# EAGLE design Bipolary (EAGLE 7.7.0)
AUTHOR: Nathan Campos; REVISION: A
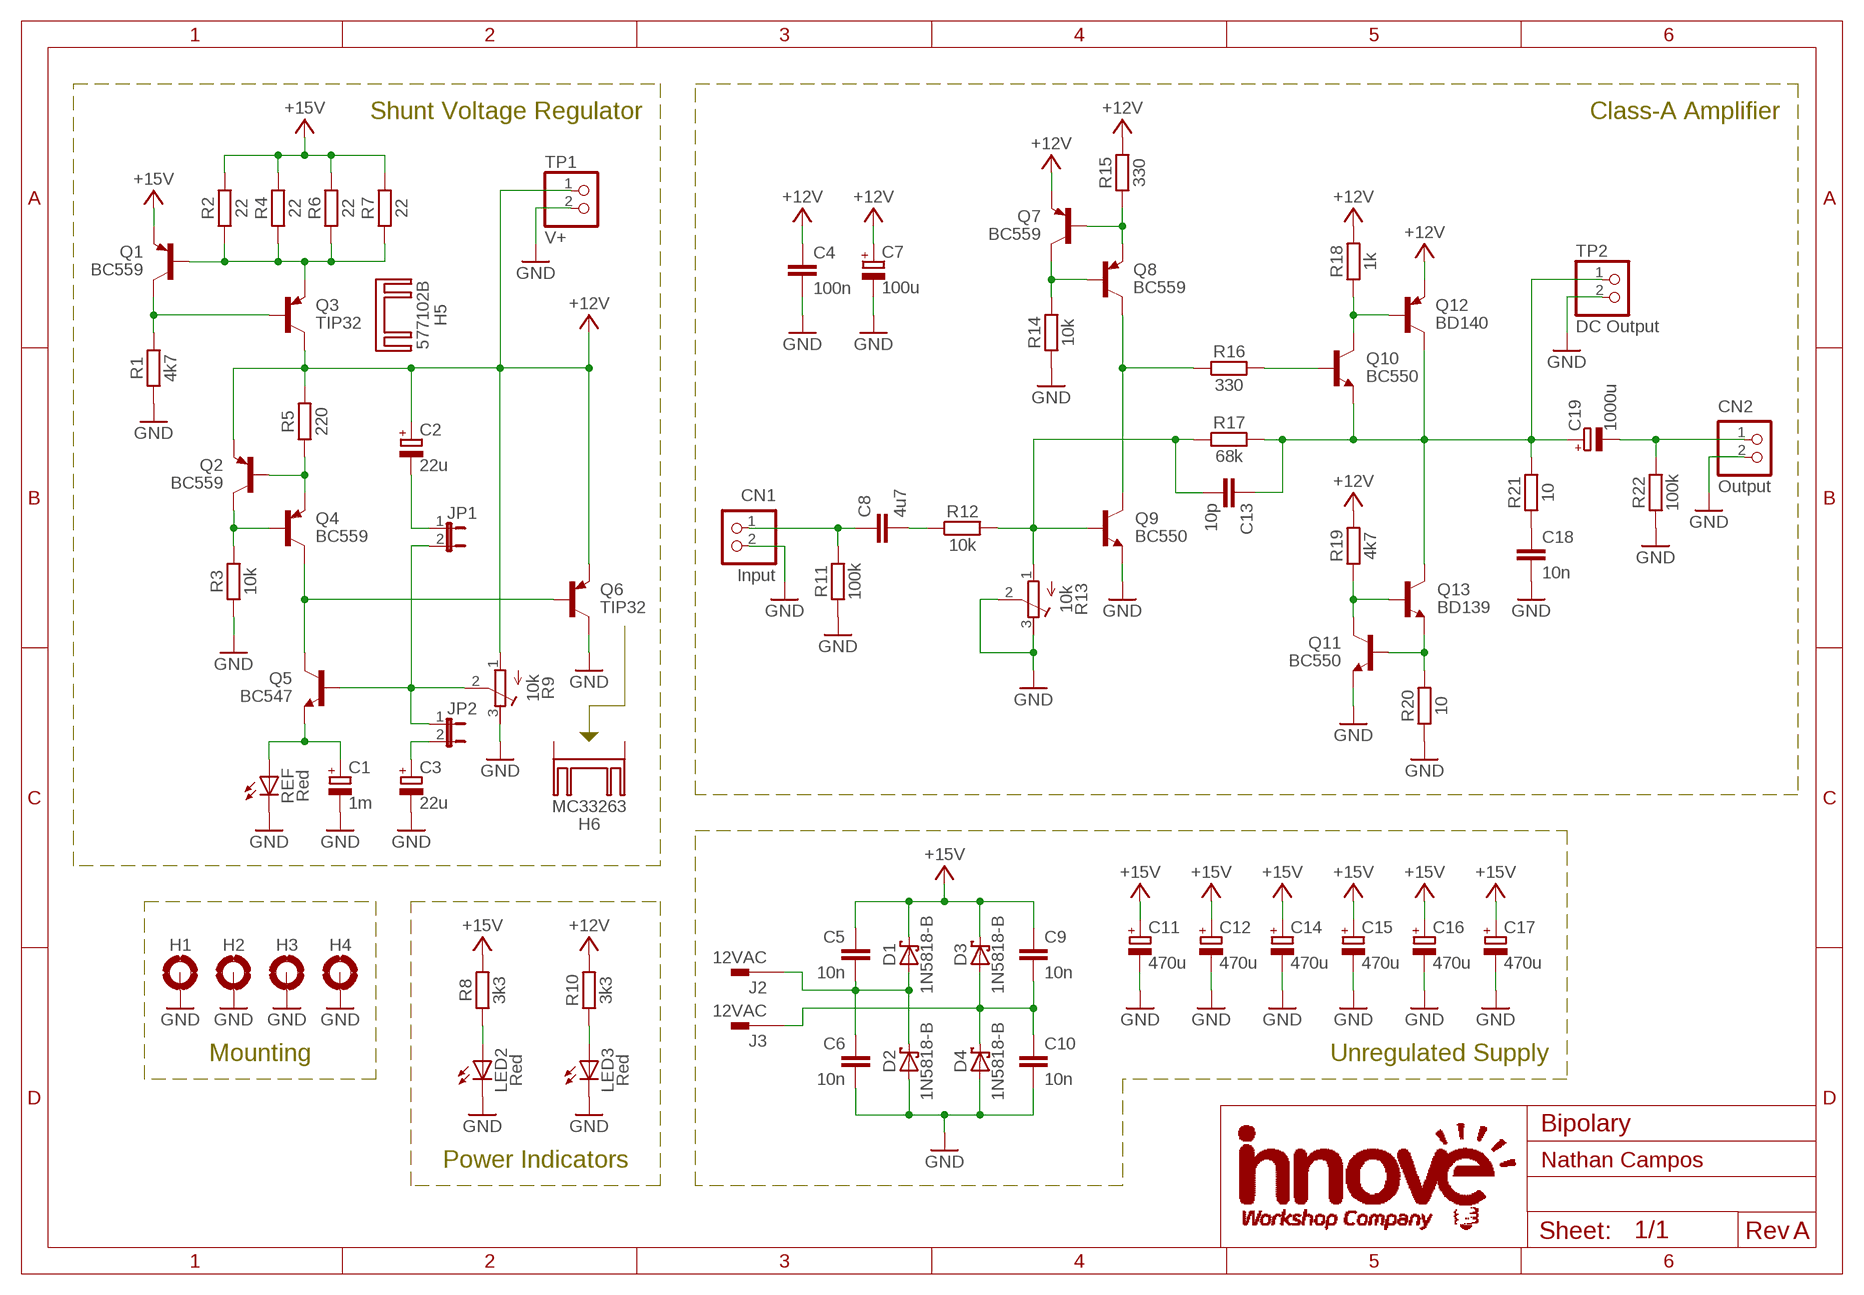
[diagram p0: schematic, sheet 1]

## Parts
C1  1m  CPOL-E3.5-8  [E3,5-8]
C2  22u  CPOL-E2-5  [E2-5]
C3  22u  CPOL-E2-5  [E2-5]
C4  100n  C5.0-2.5X7.5  [C050-025X075]
C5  10n  C5.0-2.5X7.5  [C050-025X075]
C6  10n  C5.0-2.5X7.5  [C050-025X075]
C7  100u  CPOL-E3.5-8  [E3,5-8]
C8  4u7  C15-8.4X18.3  [C150-084X183]
C9  10n  C5.0-2.5X7.5  [C050-025X075]
C10  10n  C5.0-2.5X7.5  [C050-025X075]
C11  470u  CPOL-E5-10  [E5-10]
C12  470u  CPOL-E5-10  [E5-10]
C13  10p  C5.0-2.5X7.5  [C050-025X075]
C14  470u  CPOL-E5-10  [E5-10]
C15  470u  CPOL-E5-10  [E5-10]
C16  470u  CPOL-E5-10  [E5-10]
C17  470u  CPOL-E5-10  [E5-10]
C18  10n  C5.0-2.5X7.5  [C050-025X075]
C19  1000u  CPOL-E5-10  [E5-10]
CN1  Input  B2B-XH-A  [B2B-XH-A]
CN2  Output  B2B-XH-A  [B2B-XH-A]
D1  1N5818-B  [DO41-7.6]
D2  1N5818-B  [DO41-7.6]
D3  1N5818-B  [DO41-7.6]
D4  1N5818-B  [DO41-7.6]
H1  MOUNT-PAD-ROUND3.0  [3,0-PAD]
H2  MOUNT-PAD-ROUND3.0  [3,0-PAD]
H3  MOUNT-PAD-ROUND3.0  [3,0-PAD]
H4  MOUNT-PAD-ROUND3.0  [3,0-PAD]
H5  577102B  [D02S]
H6  MC33263  [SK104-PAD]
J2  12VAC  FASTON-250D140  [F061.100]
J3  12VAC  FASTON-250D140  [F061.100]
JP1  JP1E  [JP1]
JP2  JP1E  [JP1]
LED2  Red  LED5MM  [LED5MM]
LED3  Red  LED5MM  [LED5MM]
Q1  BC559  [TO92]
Q2  BC559  [TO92]
Q3  TIP32  [TO220V]
Q4  BC559  [TO92]
Q5  BC547  [TO92]
Q6  TIP32  [TO220V]
Q7  BC559  [TO92]
Q8  BC559  [TO92]
Q9  BC550  [TO92]
Q10  BC550  [TO92]
Q11  BC550  [TO92]
Q12  BD140  [TO126V]
Q13  BD139  [TO126V]
R1  4k7  RT0207  [0207/10]
R2  22  RT0207  [0207/10]
R3  10k  RT0207  [0207/10]
R4  22  RT0207  [0207/10]
R5  220  RT0207  [0207/10]
R6  22  RT0207  [0207/10]
R7  22  RT0207  [0207/10]
R8  3k3  RT0207  [0207/10]
R9  10k  R-TRIMM3296Y  [RTRIM3296Y]
R10  3k3  RT0207  [0207/10]
R11  100k  RT0207  [0207/10]
R12  10k  RT0207  [0207/10]
R13  10k  R-TRIMM3296Y  [RTRIM3296Y]
R14  10k  RT0207  [0207/10]
R15  330  RT0207  [0207/10]
R16  330  RT0207  [0207/10]
R17  68k  RT0207  [0207/10]
R18  1k  RT0207  [0207/10]
R19  4k7  RT0207  [0207/10]
R20  10  RT0207  [0207/10]
R21  10  RT0207  [0207/10]
R22  100k  RT0207  [0207/10]
REF  Red  LED5MM  [LED5MM]
TP1  V+  PINHD-1X2  [1X02]
TP2  DC Output  PINHD-1X2  [1X02]

## Nets
+12V: C2.+ C4.1 C7.+ Q2.3(E) Q3.2(C) Q6.3(E) Q7.3(E) Q12.1(E) R5.2 R9.1(A) R10.2 R15.2 R18.2 R19.2 TP1.1
+15V: C5.1 C9.1 C11.+ C12.+ C14.+ C15.+ C16.+ C17.+ D1.C D3.C Q1.3(E) R2.2 R4.2 R6.2 R7.2 R8.2
DCOUTPUT: C13.1 C19.+ Q10.3(E) Q12.2(C) Q13.2(C) R17.2 R21.2 TP2.1
GND: C1.- C3.- C4.2 C6.2 C7.- C10.2 C11.- C12.- C14.- C15.- C16.- C17.- C18.2 CN1.2 CN2.2 D2.A D4.A H1.B3,0(MOUNT) H2.B3,0(MOUNT) H3.B3,0(MOUNT) H4.B3,0(MOUNT) LED2.K(C) LED3.K(C) Q6.2(C) Q9.3(E) Q11.3(E) R1.1 R3.1 R9.3(E) R11.1 R13.2(S) R13.3(E) R14.1 R20.1 R22.1 REF.K(C) TP1.2 TP2.2
INPUT: C8.1 CN1.1 R11.2
INTSTAGE: Q8.1(C) Q9.1(C) R16.1
N$1: Q1.1(C) Q3.1(B) R1.2
N$2: C8.2 R12.1
N$3: C5.2 C6.1 D1.A D2.C J2.A1 J2.A2
N$4: Q7.1(C) Q8.2(B) R14.2
N$5: Q7.2(B) Q8.3(E) R15.1
N$6: Q10.1(C) Q12.3(B) R18.1
N$7: Q10.2(B) R16.2
N$8: Q11.1(C) Q13.3(B) R19.1
N$9: Q11.2(B) Q13.1(E) R20.2
N$10: C18.1 R21.1
N$11: Q1.2(B) Q3.3(E) R2.1 R4.1 R6.1 R7.1
N$12: Q2.2(B) Q4.3(E) R5.1
N$13: Q2.1(C) Q4.2(B) R3.2
N$14: Q4.1(C) Q5.1(C) Q6.1(B)
N$15: C1.+ Q5.3(E) REF.A
N$16: JP1.2 JP2.1 Q5.2(B) R9.2(S)
N$17: C2.- JP1.1
N$18: C3.+ JP2.2
N$19: C9.2 C10.1 D3.A D4.C J3.A1 J3.A2
N$20: LED3.A R10.1
N$21: LED2.A R8.1
NFB: C13.2 Q9.2(B) R12.2 R13.1(A) R17.1
OUTPUT: C19.- CN2.1 R22.2
Unconnected: H6.K1(K) H6.K2(K)

## Notes on the sheet
- Shunt Voltage Regulator | Class-A Amplifier
- Mounting | Unregulated Supply
- Power Indicators

## Library data of the parts
C1-C3 C7 C11 C12 C14-C17 C19 = innove-passives:CPOL: Polarized Capacitor May come in the electrolytic and tantalum variants
C4-C6 C8-C10 C13 C18 = innove-passives:C: Ceramic Capacitor Those little yellow/brown things
CN1 CN2 = innove-con-jst-xh:B2B-XH-A: Wire-to-Board 2.5mm pitch top mount connector Source: http://www.jst-mfg.com/product/pdf/jpn/XH.pdf http://www.jst-mfg.com/product/detail.php?series=277
D1-D4 = innove-diodes:1N581*: Schottky Rectifier - 1N5817/8/9 Schottky Rectifier, 20 V, 1 A, Single, DO-41 (DO-204AL), 2 Pins, 450 mV Source: http://www.diodes.com/datasheets/ds23001.pdf
H1-H4 = innove-holes:MOUNT-PAD-ROUND: MOUNTING PAD, round
H5 = innove-heatsinks:577102B: 577102B00000G - Aavid/Boyd Heat Sink, Square, PCB, 25.9 °C/W, TO-220, 13.21 mm, 9.52 mm, 19.05 mm Datasheet: https://info.boydcorp.com/hubfs/Thermal/Air-Cooling/Boyd-Board-Level-Cooling-Channel-5770.pdf
H6 = innove-heatsinks:MC3326: MC33263/MC33264 - Multicomp Compact, vertical mounting extruded heatsink with solderable fixing pins. Designed for a single TO-220 package via clip available separately or mounting holes. MC33263 - 13.4°C/W - H 25.4mm MC33264 - 10.4°C/W - H 38.1mm
J2 J3 = innove-con-faston:FASTON-250: FASTON 250 - Printed Circuit Board Tabs Tab size: 6.35mm x 0.81mm; OC_FARNELL: unknown; OC_NEWARK: unknown
JP1 JP2 = jumper:JP1E: JUMPER
LED2 LED3 REF = innove-leds:LED: LED OSRAM: - CHIPLED LG R971, LG N971, LY N971, LG Q971, LY Q971, LO R971, LY R971 LH N974, LH R974 LS Q976, LO Q976, LY Q976 LO Q996 - Hyper CHIPLED LW Q18S LB Q993, LB Q99A, LB R99A - SideLED LS A670, LO A670, LY A670, LG A670, LP A670 LB A673, LV A673, LT A673, LW A673 LH A674 LY A675 LS A676, LA A676, LO A676, LY A676, LW A676 LS A679, LY A679, LG A679 - Hyper Micro SIDELED® LS Y876, LA Y876, LO Y876, LY Y876 LT Y87S - SmartLED LW L88C, LW L88S LB L89C, LB L89S, LG L890 LS L89K, LO L89K, LY L89K LS L896, LA L896, LO L896, LY L896 - TOPLED LS T670, LO T670, LY T670, LG T670, LP T670 LSG T670, LSP T670, LSY T670, LOP T670, LYG T670 LG T671, LOG T671, LSG T671 LB T673, LV T673, LT T673, LW T673 LH T674 LS T676, LA T676, LO T676, LY T676, LB T676, LH T676, LSB T676, LW T676 LB T67C, LV T67C, LT T67C, LS T67K, LO T67K, LY T67K, LW E67C LS E67B, LA E67B, LO E67B, LY E67B, LB E67C, LV E67C, LT E67C LW T67C LS T679, LY T679, LG T679 LS T770, LO T770, LY T770, LG T770, LP T770 LB T773, LV T773, LT T773, LW T773 LH T774 LS E675, LA E675, LY E675, LS T675 LS T776, LA T776, LO T776, LY T776, LB T776 LHGB T686 LT T68C, LB T68C - Hyper Mini TOPLED® LB M676 - Mini TOPLED Santana® LG M470 LS M47K, LO M47K, LY M47K Source: http://www.osram.convergy.de LUXEON: - LUMILED® LXK2-PW12-R00, LXK2-PW12-S00, LXK2-PW14-U00, LXK2-PW14-V00 LXK2-PM12-R00, LXK2-PM12-S00, LXK2-PM14-U00 LXK2-PE12-Q00, LXK2-PE12-R00, LXK2-PE12-S00, LXK2-PE14-T00, LXK2-PE14-U00 LXK2-PB12-K00, LXK2-PB12-L00, LXK2-PB12-M00, LXK2-PB14-N00, LXK2-PB14-P00, LXK2-PB14-Q00 LXK2-PR12-L00, LXK2-PR12-M00, LXK2-PR14-Q00, LXK2-PR14-R00 LXK2-PD12-Q00, LXK2-PD12-R00, LXK2-PD12-S00 LXK2-PH12-R00, LXK2-PH12-S00 LXK2-PL12-P00, LXK2-PL12-Q00, LXK2-PL12-R00 Source: www.luxeon.com KINGBRIGHT: KA-3528ASYC Source: www.kingbright.com
Q1 Q2 Q4 Q7 Q8 = innove-bjts:BC559
Q3 Q6 = innove-bjts:TIP32
Q5 = innove-bjts:BC547
Q9-Q11 = innove-bjts:BC550
Q12 = innove-bjts:BD140
Q13 = innove-bjts:BD139
R1-R8 R10-R12 R14-R22 = innove-passives:R: Resistor This is officially the most boring component ever.
R9 R13 = innove-passives:R-TRIMM: Trimm resistor
TP1 TP2 = pinhead:PINHD-1X2: PIN HEADER

## Board
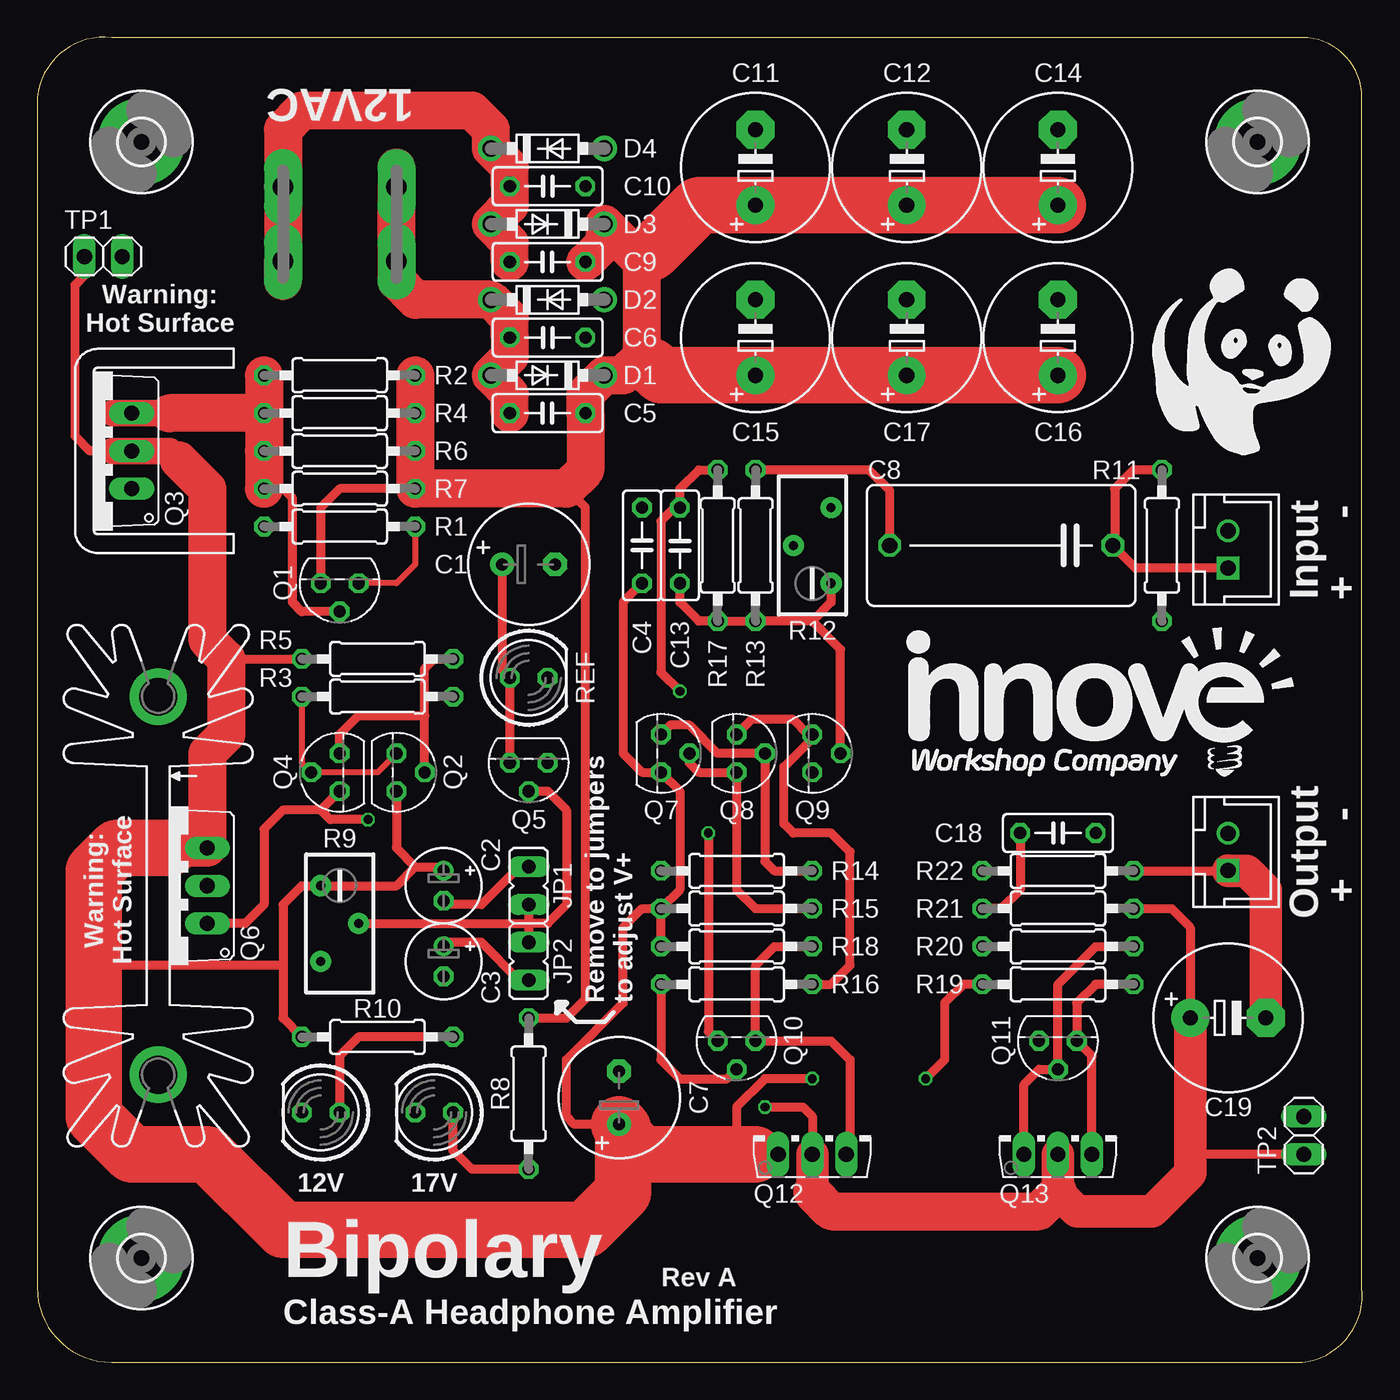
[diagram p1: board, top side]
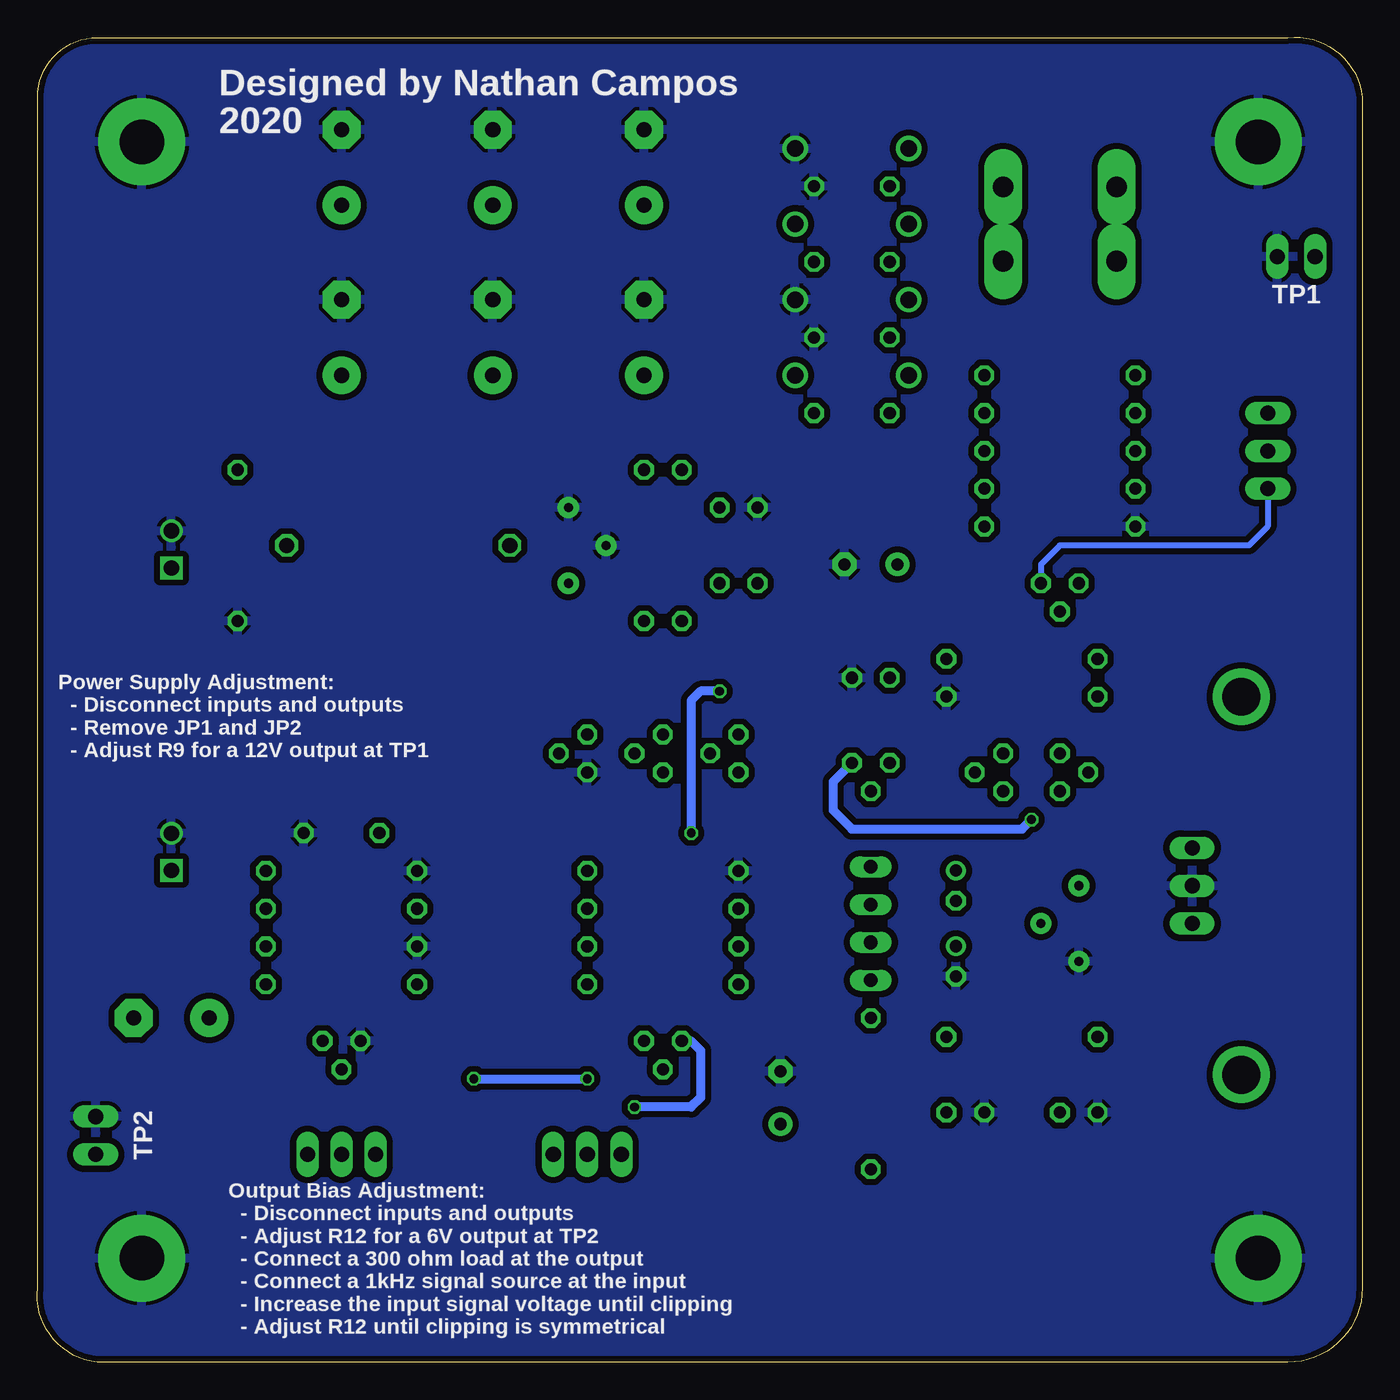
[diagram p2: board, bottom side, seen from below]

Size 89.03 x 89.03 mm. Coordinates in mm from the lower left corner, seen from the top.
Outline: 85,89 5,89 arc90 0,85 0,5 arc90 5,0 85,0 arc90 89,5 89,85 arc90 85,89
Copper layers (1*16): Top 0.035mm / dielectric 1.5mm / Bottom 0.035mm
Design rules "seeedstudio-2layers": minimum track width 6mil, minimum drill 12mil, track to track 6mil, track to pad 6mil, pad to pad 6mil, via to via 6mil, smd to smd 0mil, copper to edge 10mil, drill to drill 10mil, minimum pad ring 10mil, minimum via ring 6mil, stop-mask expansion 2mil, vias tented up to drill 100mil, thermal gap 10mil

### Footprints (pad centres in the part's own frame; a part is rotated, then mirrored left to right if it is on the bottom)
E3,5-8 = drill 0.813 pad 1.6: + -1.778,0 | drill 0.813 pad 1.6 octagon: - 1.778,0
E2-5 = drill 0.813 pad 1.27: + -1.016,0 | drill 0.813 pad 1.27 octagon: - 1.016,0
C050-025X075 = drill 0.813 octagon: 1 -2.54,0; 2 2.54,0
C150-084X183 = drill 1.016 octagon: 1 -7.493,0; 2 7.493,0
E5-10 = drill 1.016 pad 2.54: + -2.54,0 | drill 1.016 pad 2.54 octagon: - 2.54,0
B2B-XH-A = drill 1.016 square: 1 -1.25,0 | drill 1.016: 2 1.25,0
DO41-7.6 = drill 1.1 pad 1.7: A 3.81,0; C -3.81,0
3,0-PAD = drill 3 pad 5.842: B3,0 0,0
SK104-PAD = drill 2.54 pad 3.81: K1 -12.7,-0.762; K2 12.7,-0.762
F061.100 = drill 1.4 pad 2.54 long: A1 -2.5,0; A2 2.5,0
JP1 = drill 0.914 long: 1 0,-1.27; 2 0,1.27
LED5MM = drill 0.813 octagon: A -1.27,0; K 1.27,0
TO92 = drill 0.813 octagon: 1 -1.27,0; 2 0,1.905; 3 1.27,0
TO220V = drill 1.016 long: 1 -2.54,-2.54; 2 0,-2.54; 3 2.54,-2.54
TO126V = drill 1.016 long: 1 -2.286,-1.27; 2 0,-1.27; 3 2.286,-1.27
0207/10 = drill 0.813 octagon: 1 -5.08,0; 2 5.08,0
RTRIM3296Y = drill 0.61 pad 1.422: 1 1.27,-2.54; 2 -1.27,0; 3 1.27,2.54
1X02 = drill 1.016 long: 1 -1.27,0; 2 1.27,0

### Placement (x,y rotation side)
C1  33.02,53.61 0 top
C2  27.3,32.02 270 top
C3  27.3,26.94 270 top
C4  40.64,54.88 90 top
C5  34.29,63.77 180 top
C6  34.29,68.85 0 top
C7  39.1,17.78 90 top
C8  64.77,54.88 180 top
C9  34.29,73.93 180 top
C10  34.29,79.01 0 top
C11  48.26,80.28 90 top
C12  58.42,80.28 90 top
C13  43.18,54.88 270 top
C14  68.58,80.28 90 top
C15  48.26,68.85 90 top
C16  68.58,68.85 90 top
C17  58.42,68.85 90 top
C18  68.58,35.56 0 top
C19  80.01,23.13 0 top
CN1  80.01,54.61 90 top
CN2  80.01,34.29 90 top
D1  34.29,66.31 180 top
D2  34.29,71.39 0 top
D3  34.29,76.47 180 top
D4  34.29,81.55 0 top
H1  7,7 0 top
H2  82,7 0 top
H3  82,82 0 top
H4  7,82 0 top
H5  3.81,61.23 270 top
H6  8.89,32.02 270 top
J2  24.13,76.47 270 top
J3  16.51,76.47 270 top
JP1  33.02,32.02 180 top
JP2  33.02,26.94 180 top
LED2  26.67,16.78 180 top
LED3  19.05,16.78 180 top
Q1  20.32,52.34 180 top
Q2  24.13,39.64 270 top
Q3  3.81,61.23 90 top
Q4  20.32,39.64 90 top
Q5  33.02,40.27 180 top
Q6  8.89,32.02 90 top
Q7  41.91,40.91 270 top
Q8  46.99,40.91 270 top
Q9  52.07,40.91 270 top
Q10  46.99,21.59 180 top
Q11  68.58,21.59 180 top
Q12  52.07,15.24 0 top
Q13  68.58,15.24 0 top
R1  20.32,56.15 0 top
R2  20.32,66.31 0 top
R3  22.86,44.72 180 top
R4  20.32,63.77 0 top
R5  22.86,47.26 180 top
R6  20.32,61.23 0 top
R7  20.32,58.69 0 top
R8  33.02,18.05 90 top
R9  20.32,29.48 180 top
R10  22.86,21.86 180 top
R11  75.56,54.88 90 top
R12  48.26,54.88 270 top
R13  52.07,54.88 0 top
R14  46.99,33.02 0 top
R15  46.99,30.48 180 top
R16  46.99,25.4 180 top
R17  45.72,54.88 90 top
R18  46.99,27.94 180 top
R19  68.58,25.4 180 top
R20  68.58,27.94 0 top
R21  68.58,30.48 0 top
R22  68.58,33.02 0 top
REF  33.02,45.99 0 top
TP1  4.45,74.3 0 top
TP2  85.09,15.24 90 top

### Tracks (layer width: path | path; a pad name or v marks a point on that pad's centre or on a via)
+12V  (via drill 0.6)
  Top 0.61: 12.7,47.26 R5.2 | 25.4,33.29 24.13,32.02 R9.1 17.78,32.02 16.51,30.75 16.51,26.67 | 25.4,33.29 27.05,33.29 C2.+ | Q2.3 24.13,34.56 25.4,33.29 | R10.2 16.51,23.13 16.51,26.67 | C4.1 39.37,51.07 39.37,40.91 40.64,39.64 Q7.3 43.18,38.37 43.18,31.75 R15.2 | R18.2 R15.2 | C7.+ 36.07,16 35.56,16.51 35.56,20.32 39.37,24.13 39.37,29.21 40.64,30.48 R15.2 | R19.2 62.23,25.4 60.96,24.13 60.96,20.32 v59.69,19.05 | v52.07,19.05 48.9,19.05 46.99,17.14 46.99,13.97 | 16.51,26.67 3.81,26.67 | TP1.1 3.17,73.03 2.54,72.39 2.54,62.23 3.54,61.23 5.08,61.23
  Top 1.016: 11.43,35.2 Q6.3
  Top 1.422: 48.26,13.97 Q12.1
  Top 1.778: 5.08,61.23 Q3.2 8.89,61.23 9.53,60.59
  Top 2.54: 9.53,60.59 11.43,58.69 11.43,48.53 12.7,47.26 12.7,42.18 11.43,40.91 11.43,35.2 | Q6.3 9.92,34.56 9.91,34.54 8.89,34.54
  Top 3.81: 8.89,34.54 5.33,34.54 3.81,33.02 3.81,26.67 3.81,16.51 6.35,13.97 11.43,13.97 16.51,8.89 36.83,8.89 39.37,11.43 39.37,15.24 | C7.+ 39.37,15.73 39.37,15.24 | 39.37,15.24 40.64,13.97 46.99,13.97 48.26,13.97
  Bottom 0.61: v59.69,19.05 v52.07,19.05
+15V
  Top 0.61: R7.2 20.32,58.69 19.05,57.42 Q1.3 | 35.56,58.69 36.83,57.42 36.83,24.4 35.56,23.13 R8.2
  Top 1.93: 41.27,66.94 40.64,67.58 | 41.27,74.56 40.64,73.93
  Top 2.54: C9.1 38.1,75.2 D3.C 40.64,73.93 40.64,67.58 39.37,66.31 D1.C 36.83,65.04 C5.1 36.83,59.96 35.56,58.69 R7.2 R6.2 R4.2 R2.2
  Top 3.81: C14.+ C12.+ C11.+ 44.45,77.74 41.27,74.56 | C16.+ C17.+ C15.+ 41.91,66.31 41.27,66.94
DCOUTPUT  (via drill 0.6)
  Top 0.61: R17.2 44.45,59.96 43.18,58.69 C13.1 42.81,57.42 41.91,56.52 41.91,46.35 v43.18,45.09 | v48.9,17.14 51.44,17.14 52.07,16.51 Q12.2 | R21.2 76.2,30.48 77.47,29.21 C19.+ | v45.09,35.56 45.09,22.23 Q10.3 | TP2.1 77.47,13.97
  Top 2.184: Q12.2 52.07,11.43 | Q13.2 68.58,11.43 69.85,10.16 74.93,10.16 77.47,12.7 77.47,13.97 C19.+
  Top 2.54: 52.07,11.43 53.34,10.16 67.31,10.16 68.58,11.43
  Bottom 0.61: v48.9,17.14 45.09,17.14 44.45,17.78 44.45,20.95 45.09,21.59 Q10.3 | v43.18,45.09 44.45,45.09 45.09,44.45 v45.09,35.56
GND
  pour Bottom (isolate 0.406): -1.27,90.17 90.17,90.17 90.17,-1.27 -1.27,-1.27
INPUT
  Top 0.61: R11.2 73.66,59.96 72.39,58.69 72.39,55.01 C8.1 73.78,53.36 CN1.1
INTSTAGE
  Top 0.61: R16.1 53.34,25.4 54.61,26.67 54.61,34.29 53.34,35.56 50.8,35.56 50.16,36.2 50.16,40.01 52.07,41.91 Q9.1 51.8,42.18 50.8,43.18 47.99,43.18 Q8.1
N$1
  Top 0.406: R1.2 25.4,53.61 24.13,52.34 Q1.1
  Bottom 0.406: Q3.1 6.35,56.15 7.62,54.88 20.32,54.88 21.59,53.61 Q1.1
N$2
  Top 0.61: C8.2 57.28,58.56 55.88,59.96 R12.1
N$3
  Top 2.54: C5.2 31.75,65.04 D1.A 31.75,67.58 C6.1 31.75,70.12 D2.C 25.4,71.39 24.13,72.66 J2.A2 J2.A1 24.13,80.28
N$4
  Top 0.61: Q7.1 42.55,42.81 43.81,42.81 45.72,40.91 Q8.2 48.9,33.66 49.53,33.02 R14.2
N$5
  Top 0.61: Q7.2 43.81,40.27 44.45,39.64 Q8.3 46.99,31.75 48.26,30.48 R15.1
N$6
  Top 0.61: R18.1 49.53,27.94 48.26,26.67 Q10.1 53.34,21.59 54.61,20.32 54.61,14.22 Q12.3
N$7
  Top 0.61: R16.2 41.91,20.32 43.18,19.05 46.35,19.05 Q10.2
N$8
  Top 0.61: Q13.3 70.87,20.57 Q11.1 69.85,24.13 71.12,25.4 R19.1
N$9
  Top 0.61: Q13.1 66.29,18.67 67.31,19.68 Q11.2 68.58,25.4 71.12,27.94 R20.2
N$10
  Top 0.61: C18.1 66.04,31.75 64.77,30.48 R21.1
N$11
  Top 0.61: Q1.2 17.78,50.44 17.14,51.07 17.14,58.05 16.51,58.69 R7.1
  Top 1.778: 8.89,63.77 Q3.3 5.08,63.77
  Top 2.54: R2.1 R4.1 | R4.1 R6.1 R7.1 | R4.1 8.89,63.77
N$12
  Top 0.61: Q2.2 26.04,43.45 | 26.04,43.45 26.04,46.62 26.67,47.26 R5.1 | Q4.3 20.32,42.18 21.59,43.45 26.04,43.45
N$13
  Top 0.406: Q2.1 22.86,39.64 Q4.2 17.78,40.27 R3.2
N$14  (via drill 0.6)
  Top 0.61: Q4.1 19.05,37.1 | 19.05,37.1 16.51,37.1 15.24,35.83 15.24,30.75 13.97,29.48 Q6.1 | v22.23,36.47 19.68,36.47 19.05,37.1
  Bottom 0.61: Q5.1 35.56,39.01 35.56,37.1 34.29,35.83 22.86,35.83 v22.23,36.47
N$15
  Top 0.61: C1.+ 31.24,46.5 REF.A Q5.3
N$16
  Top 0.61: JP1.2 33.02,29.48 | 33.02,29.48 JP2.1 | R9.2 33.02,29.48 | Q5.2 34.29,38.37 35.56,37.1 35.56,30.75 34.29,29.48 33.02,29.48
N$17
  Top 0.61: JP1.1 32.38,33.29 29.84,30.75 27.56,30.75 C2.-
N$18
  Top 0.61: JP2.2 32.38,25.67 29.84,28.21 27.56,28.21 C3.+
N$19
  Top 2.54: C9.2 31.75,75.2 D3.A 31.75,77.74 C10.1 31.75,80.28 D4.C 30.48,82.82 29.21,84.09 17.78,84.09 16.51,82.82 J3.A1 J3.A2 16.51,72.66
N$20
  Top 0.61: R10.1 21.59,21.86 20.32,20.59 LED3.A
N$21
  Top 0.61: R8.1 29.21,12.97 27.94,14.24 LED2.A
NFB
  Top 0.61: R13.1 53.34,51.07 52.07,49.8 | 52.07,49.8 R12.2 R17.1 44.45,49.8 43.18,51.07 C13.2 | Q9.2 53.98,47.9 52.07,49.8
OUTPUT
  Top 0.61: R22.2 79.99,33.02 CN2.1
  Top 2.184: C19.- 82.55,31.75 81.28,33.02 80.01,33.02 CN2.1

### Text on the board
tPlace: 12VAC | Warning: / Hot Surface | - | Input | + | - | Output | Warning: / Hot Surface | + | Remove to jumpers / to adjust V+ | 12V | 17V | Bipolary | Rev A | Class-A Headphone Amplifier
bPlace: Designed by Nathan Campos | 2020 | TP1 | Power Supply Adjustment: / - Disconnect inputs and outputs / - Remove JP1 and JP2 / - Adjust R9 for a 12V output at TP1 | TP2 | Output Bias Adjustment: / - Disconnect inputs and outputs / - Adjust R12 for a 6V output at TP2 / - Connect a 300 ohm load at the output / - Connect a 1kHz signal source at the input / - Increase the input signal voltage until clipping / - Adjust R12 until clipping is symmetrical